# Altium schematic sheet XC7A35TFTG256_bank0.SchDoc
size A4; DocumentNumber: 15; SheetNumber: 15; SheetTotal: 21; SheetName: FPGA Bank 0
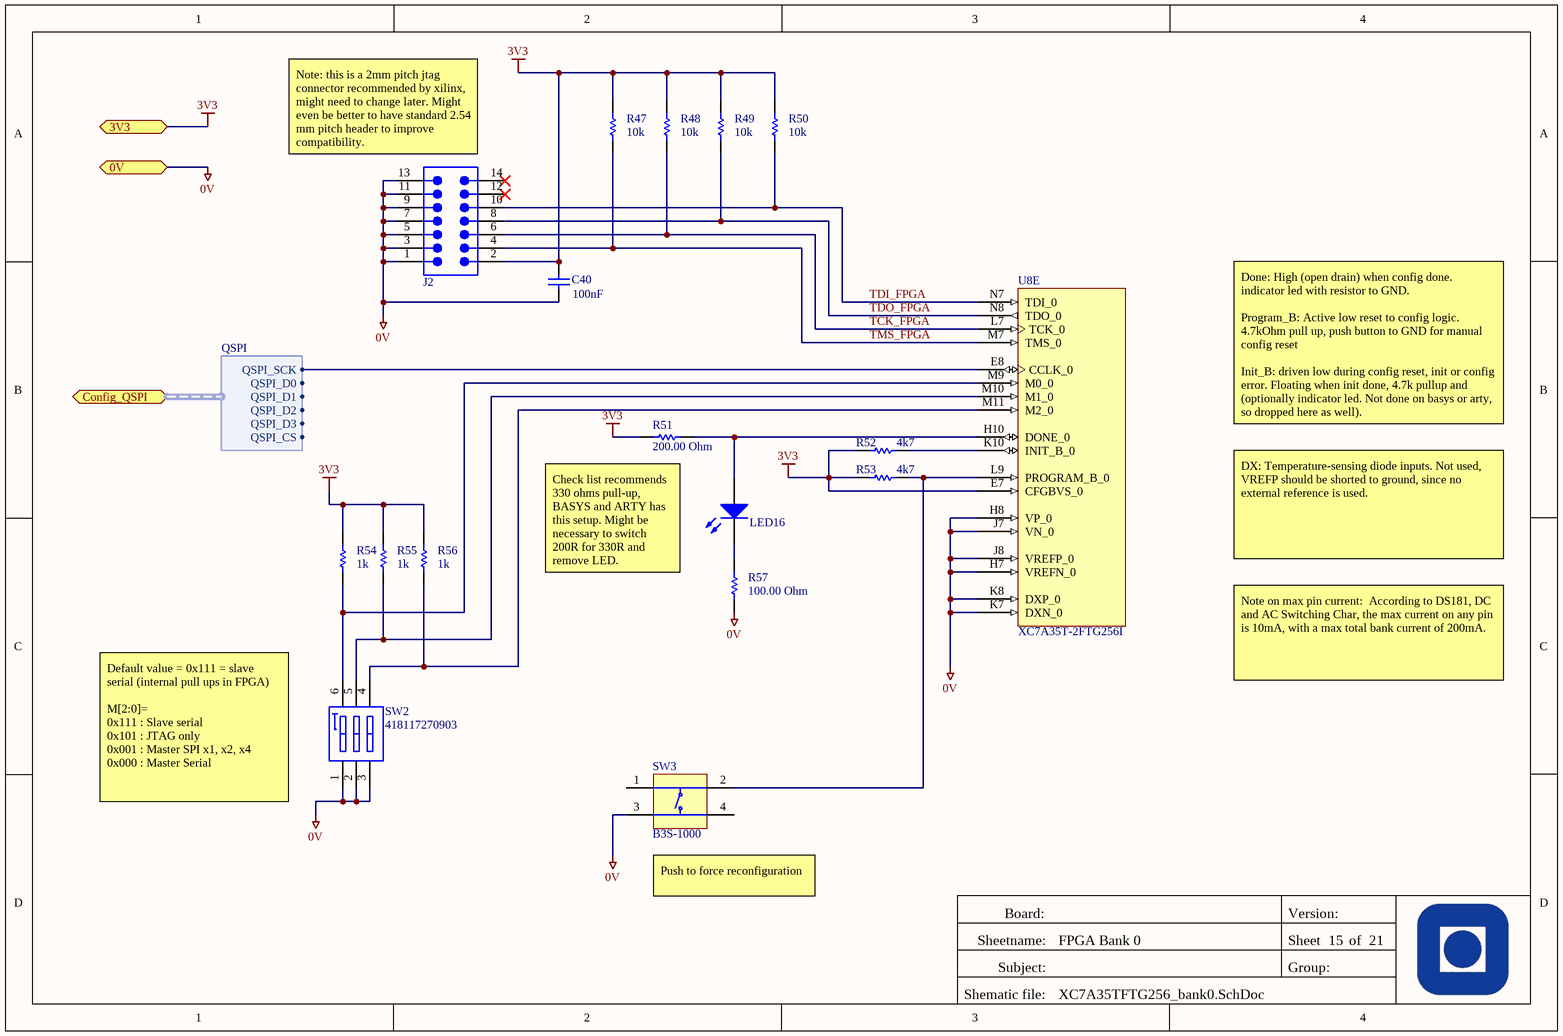
[diagram p0: XC7A35TFTG256_bank0.SchDoc]

## Parts
C40  value 100nF  [CAPC0603(1608)100_M]  (hidden comment: CAP 100nF 16V 0603(1608))
J2  2x7 2mm header  [2x7 2mm]  (value not drawn)
LED16  150060RS75000  [0603_A]  (value not drawn)
R47  value 10k  [RESC0603(1608)_N]  (hidden comment: 10K 5% 0603(1608))
R48  value 10k  [RESC0603(1608)_N]  (hidden comment: 10K 5% 0603(1608))
R49  value 10k  [RESC0603(1608)_N]  (hidden comment: 10K 5% 0603(1608))
R50  value 10k  [RESC0603(1608)_N]  (hidden comment: 10K 5% 0603(1608))
R51  value 200.00 Ohm  [RESC0603(1608)_L]  (hidden comment: 200R 5% 0603(1608))
R52  value 4k7  [RESC0603(1608)_N]  (hidden comment: 4K7 1% 0603(1608))
R53  value 4k7  [RESC0603(1608)_N]  (hidden comment: 4K7 1% 0603(1608))
R54  value 1k  [RESC0603(1608)_L]  (hidden comment: 1K 5% 0603(1608))
R55  value 1k  [RESC0603(1608)_L]  (hidden comment: 1K 5% 0603(1608))
R56  value 1k  [RESC0603(1608)_L]  (hidden comment: 1K 5% 0603(1608))
R57  value 100.00 Ohm  [RESC0603(1608)_L]  (hidden comment: 100R 5% 0603(1608))
SW2  418117270903  [418117270903]
SW3  B3S-1000  [OMRON-B3S-1000-4_V]
U8  XC7A35T-2FTG256I  [FTG256]  (part E of 8)

## Ports
0V, 3V3, Config_QSPI (harness QSPI)

## Harnesses
QSPI: QSPI_D0, QSPI_D1, QSPI_D2, QSPI_D3, QSPI_SCK, QSPI_CS

## Nets
0V: C40.1 J2.1 J2.3 J2.5 J2.7 J2.9 J2.11 J2.13 R57.1 SW2.1 SW2.2 SW2.3 SW3.3 U8.H7(VREFN_0) U8.H8(VP_0) U8.J7(VN_0) U8.J8(VREFP_0) U8.K7(DXN_0) U8.K8(DXP_0) ; port 0V
3V3: C40.2 J2.2 R47.2 R48.2 R49.2 R50.2 R51.1 R52.1 R53.1 R54.2 R55.2 R56.2 U8.E7(CFGBVS_0) ; port 3V3
TCK_FPGA: J2.6 R48.1 U8.L7(TCK_0)
TDI_FPGA: J2.10 R50.1 U8.N7(TDI_0)
TDO_FPGA: J2.8 R49.1 U8.N8(TDO_0)
TMS_FPGA: J2.4 R47.1 U8.M7(TMS_0)
NetLED16_1: LED16.1(K) R57.2
NetLED16_2: LED16.2(A) R51.2 U8.H10(DONE_0)
NetR52_2: R52.2 U8.K10(INIT_B_0)
NetR53_2: R53.2 SW3.2 U8.L9(PROGRAM_B_0)
NetR54_1: R54.1 SW2.6 U8.M9(M0_0)
NetR55_1: R55.1 SW2.5 U8.M10(M1_0)
NetR56_1: R56.1 SW2.4 U8.M11(M2_0)
NetU8_E8: U8.E8(CCLK_0) ; port Config_QSPI.QSPI_SCK

Not connected (* = marked no-connect by the designer): J2 12* 14*; SW3 1 4

## Notes on the sheet
- (near J2) Note: this is a 2mm pitch jtag connector recommended by xilinx, might need to change later. Might even be better to have standard 2.54 mm pitch header to improve compatibility.
- Done: High (open drain) when config done. indicator led with resistor to GND.
  Program_B: Active low reset to config logic. 4.7kOhm pull up, push button to GND for manual config reset
  Init_B: driven low during config reset, init or config error. Floating when init done, 4.7k pullup and (optionally indicator led. Not done on basys or arty, so dropped here as well).
- (near R51) Check list recommends 330 ohms pull-up, BASYS and ARTY has this setup. Might be necessary to switch 200R for 330R and remove LED.
- DX: Temperature-sensing diode inputs. Not used,
  VREFP should be shorted to ground, since no external reference is used.
- Note on max pin current:  According to DS181, DC and AC Switching Char, the max current on any pin is 10mA, with a max total bank current of 200mA.
- Default value = 0x111 = slave serial (internal pull ups in FPGA)
  M[2:0]=
  0x111 : Slave serial
  0x101 : JTAG only
  0x001 : Master SPI x1, x2, x4
  0x000 : Master Serial
- (near SW3) Push to force reconfiguration
- Board:
- Version:
- Sheetname:
- Subject:
- Group:
- Sheet
- of
- Shematic file:

## Library data of the parts
C40 = CMP-1035-02583-1: CAP 100nF 16V ±5% 0603 (1608 Metric) Thickness 1mm SMD; Tolerance: Â±5%; Case-Metric: 1608; Case-EIA: 0603; Rated Voltage: 16 V; Max Thickness: 1 mm; Technology: SMT
J2 = 2x7 2mm header: 2 x 7 2mm pitch vertical header; Supplier 1: Digi-Key; Supplier Part Number 1: WM17469-ND
LED16 = CMP-1426-00001-1: SMD mono-color Chip LED, WL-SMCW, Red; Manufacturer: Wuerth Elektronik; Color: Red; PackageReference: 0603_A; ComponentLink2URL: http://katalog.we-online.com/led/datasheet/150060RS75000.pdf; ComponentLink1URL: http://www.we-online.com; ComponentLink1Description: Manufacturer URL; ComponentLink2Description: Datasheet; PartNumber: 150060RS75000
R47-R50 = CMP-1012-00098-1: 10K 0.1W 5% 0603 (1608 Metric)  SMD; Case-EIA: 0603; Case-Metric: 1608; Technology: SMT; Tolerance: 5 %; Power: 0.1 W
R51 = CMP-1012-00057-1: 200R 0.1W 5% 0603 (1608 Metric)  SMD; Case-EIA: 0603; Case-Metric: 1608; Technology: SMT; Tolerance: 5 %; Power: 0.1 W
R52 R53 = CMP-1012-00586-1: 4K7 0.1W 1% 0603 (1608 Metric)  SMD; Case-EIA: 0603; Case-Metric: 1608; Power: 0.1 W; Tolerance: 1 %; Technology: SMT
R54-R56 = CMP-1012-00074-1: 1K 0.1W 5% 0603 (1608 Metric)  SMD; Case-EIA: 0603; Case-Metric: 1608; Technology: SMT; Tolerance: 5 %; Power: 0.1 W
R57 = CMP-1012-00050-1: 100R 0.1W 5% 0603 (1608 Metric)  SMD; Case-EIA: 0603; Case-Metric: 1608; Tolerance: 5 %; Technology: SMT; Power: 0.1 W
SW2 = CMP-1435-00003-1: WS-DITV 2.54 mm Compact THT Dip Switch with Raised Actuator; Manufacturer: Wuerth Elektronik; NoPins: 6; PackageReference: 418117270903; ComponentLink2Description: Datasheet; ComponentLink1URL: http://www.we-online.com; ComponentLink1Description: Manufacturer URL; PartNumber: 418117270903; ComponentLink2URL: http://katalog.we-online.de/em/datasheet/4181172709xx.pdf
SW3 = CMP-1677-00001-3: Sealed Tactile Switch, SPST-NO, 3 to 24 V, -25 to 70 degC, 4-Pin SMD, RoHS, Bulk; Current Rating: 50 mA; Voltage Rating: 24 V; Packaging: Bulk; PackageDescription: 4-Pin Surface Mount Device, Body 6.6 x 6 mm; Height: 4.3 mm; RoHSCompliant: true; REACH SVHC: No SVHC; Package Quantity: 1500; Mounting Technology: Surface Mount; Contact Plating: Silver; PackageReference: B3S-1000; Min Operating Temperature: -25 degC; DatasheetVersion: 10/2014; Mount: Surface Mount; Length: 6.6 mm; Max Operating Temperature: 70 degC
U8 = CMP-0383-00025-1: Artix-7 FPGA, 170 User I/Os, 0 GTP, 256-Ball BGA, Speed Grade 2, Industrial Grade, Pb-Free; Manufacturer: Xilinx; Logic Cells: 33280; GTP: 0; CMTs: 5; Available User I/O: 170; Total Block RAM: 1800 Kb; Speed Grades: 2; ComponentLink3Description: Pinout; ComponentLink4Description: Package Specification; ComponentLink2URL: http://www.xilinx.com/support/documentation/data_sheets/ds180_7Series_Overview.pdf; DatasheetVersion: Rev. 1.15; PackageVersion: Rev. 1.11; ComponentLink3URL: http://www.xilinx.com/support/documentation/user_guides/ug475_7Series_Pkg_Pinout.pdf; ComponentLink1Description: Manufacturer URL; PackageReference: FTG-256; ComponentLink1URL: http://www.xilinx.com/; ComponentLink4URL: http://www.xilinx.com/support/documentation/user_guides/ug475_7Series_Pkg_Pinout.pdf; Mounting Technology: Surface Mount; Maximum Distributed RAM: 400 Kb; PackageDescription: 256-Ball Wire-Bond Fine-Pitch Thin BGA, Body 17 x 17 mm, Pitch 1 mm; ComponentLink2Description: Datasheet; Operating Temperature Range: Industrial; PartNumber: XC7A35T-2FTG256I; PartId: 1